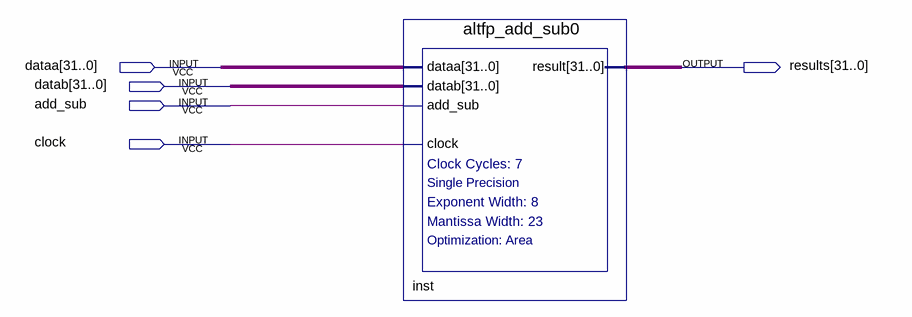
[diagram p0: schematic sheet]
// Quartus schematic FloatAddSub.bdf as structural Verilog: 1 symbols, 5 pins
module FloatAddSub (
  input  [31:0] dataa,
  input  [31:0] datab,
  input  add_sub,
  input  clock,
  output [31:0] results
);

  altfp_add_sub0 inst (.dataa(dataa), .datab(datab), .add_sub(add_sub), .clock(clock), .result(results));
endmodule
